# Altium project FPGA_Module.PrjPcb
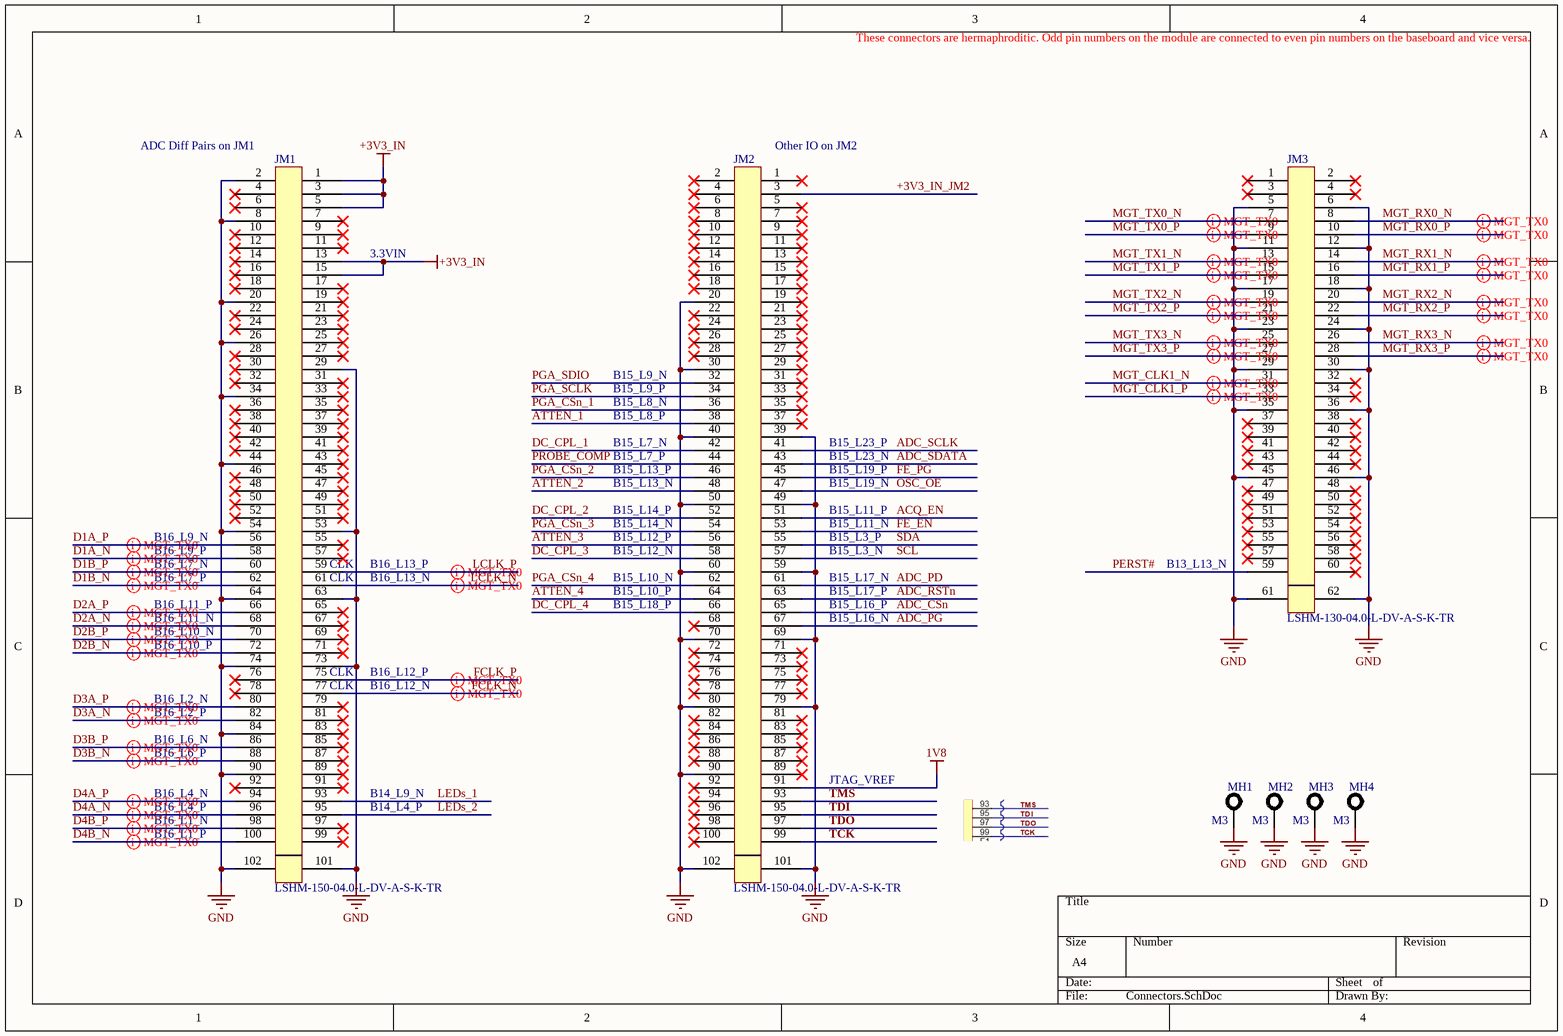
[diagram p0: Connectors.SchDoc]
2 sheets, 10 parts. Net scope: global (net labels, ports and power ports of the same name join across sheets).
Board file: FPGA_Module.PcbDoc
Sheets:
  Connectors.SchDoc
  FPGA_Banks_DDR3.SchDoc

## Sheet Connectors.SchDoc
size A4; SheetNumber: 1; SheetTotal: 8

### Parts
JM1  LSHM-150-04.0-L-DV-A-S-K-TR  [SAM_LSHM-150-XX.X-XX-DV-A-S]
JM2  LSHM-150-04.0-L-DV-A-S-K-TR  [SAM_LSHM-150-XX.X-XX-DV-A-S]
JM3  LSHM-130-04.0-L-DV-A-S-K-TR  [SAM_LSHM-130-XX.X-XX-DV-A-S]
MH1  M3  [MH M3]  (no BOM)
MH2  M3  [MH M3]  (no BOM)
MH3  M3  [MH M3]  (no BOM)
MH4  M3  [MH M3]  (no BOM)

### Nets
1V8: JM2.91
+3V3_IN: JM1.1 JM1.3 JM1.5 JM1.13 JM1.15
GND: JM1.2 JM1.8 JM1.20 JM1.26 JM1.29 JM1.34 JM1.44 JM1.53 JM1.54 JM1.63 JM1.64 JM1.73 JM1.74 JM1.84 JM1.90 JM1.101 JM1.102 JM2.20 JM2.30 JM2.39 JM2.40 JM2.49 JM2.50 JM2.59 JM2.60 JM2.69 JM2.70 JM2.79 JM2.80 JM2.90 JM2.101 JM2.102 JM3.5 JM3.6 JM3.11 JM3.12 JM3.17 JM3.18 JM3.23 JM3.24 JM3.29 JM3.30 JM3.35 JM3.36 JM3.45 JM3.46 JM3.61 JM3.62 MH1.1 MH2.1 MH3.1 MH4.1
+3V3_IN_JM2: JM2.3
ACQ_EN: JM2.51
ADC_CSn: JM2.65
ADC_PD: JM2.61
ADC_PG: JM2.67
ADC_RSTn: JM2.63
ADC_SCLK: JM2.41
ADC_SDATA: JM2.43
ATTEN_1: JM2.38
ATTEN_2: JM2.48
ATTEN_3: JM2.56
ATTEN_4: JM2.64
D1A_N: JM1.58
D1A_P: JM1.56
D1B_N: JM1.62
D1B_P: JM1.60
D2A_N: JM1.68
D2A_P: JM1.66
D2B_N: JM1.72
D2B_P: JM1.70
D3A_N: JM1.82
D3A_P: JM1.80
D3B_N: JM1.88
D3B_P: JM1.86
D4A_N: JM1.96
D4A_P: JM1.94
D4B_N: JM1.100
D4B_P: JM1.98
DC_CPL_1: JM2.42
DC_CPL_2: JM2.52
DC_CPL_3: JM2.58
DC_CPL_4: JM2.66
FCLK_N: JM1.77
FCLK_P: JM1.75
FE_EN: JM2.53
FE_PG: JM2.45
LCLK_N: JM1.61
LCLK_P: JM1.59
LEDs_1: JM1.93
LEDs_2: JM1.95
MGT_CLK1_N: JM3.31
MGT_CLK1_P: JM3.33
MGT_RX0_N: JM3.8
MGT_RX0_P: JM3.10
MGT_RX1_N: JM3.14
MGT_RX1_P: JM3.16
MGT_RX2_N: JM3.20
MGT_RX2_P: JM3.22
MGT_RX3_N: JM3.26
MGT_RX3_P: JM3.28
MGT_TX0_N: JM3.7
MGT_TX0_P: JM3.9
MGT_TX1_N: JM3.13
MGT_TX1_P: JM3.15
MGT_TX2_N: JM3.19
MGT_TX2_P: JM3.21
MGT_TX3_N: JM3.25
MGT_TX3_P: JM3.27
OSC_OE: JM2.47
PERST#: JM3.59
PGA_CSn_1: JM2.36
PGA_CSn_2: JM2.46
PGA_CSn_3: JM2.54
PGA_CSn_4: JM2.62
PGA_SCLK: JM2.34
PGA_SDIO: JM2.32
PROBE_COMP: JM2.44
SCL: JM2.57
SDA: JM2.55
TCK: JM2.99
TDI: JM2.95
TDO: JM2.97
TMS: JM2.93

Not connected (* = marked no-connect by the designer): JM1 4* 6* 7* 9* 10* 11* 12* 14* 16* 17* 18* 19* 21* 22* 23* 24* 25* 27* 28* 30* 31* 32* 33* 35* 36* 37* 38* 39* 40* 41* 42* 43* 45* 46* 47* 48* 49* 50* 51* 52* 55* 57* 65* 67* 69* 71* 76* 78* 79* 81* 83* 85* 87* 89* 91* 92* 97* 99*; JM2 1* 2* 4* 5* 6* 7* 8* 9* 10* 11* 12* 13* 14* 15* 16* 17* 18* 19* 21* 22* 23* 24* 25* 26* 27* 28* 29* 31* 33* 35* 37* 68* 71* 72* 73* 74* 75* 76* 77* 78* 81* 82* 83* 84* 85* 86* 87* 88* 89* 92* 94* 96* 98* 100*; JM3 1* 2* 3* 4* 32* 34* 37* 38* 39* 40* 41* 42* 43* 44* 47* 48* 49* 50* 51* 52* 53* 54* 55* 56* 57* 58* 60*

### Layout directives
differential pair; differential pair class PCIe: MGT_CLK1_N, MGT_CLK1_P, MGT_RX0_N, MGT_RX0_P, MGT_RX1_N, MGT_RX1_P, MGT_RX2_N, MGT_RX2_P, MGT_RX3_N, MGT_RX3_P, MGT_TX0_N, MGT_TX0_P, MGT_TX1_N, MGT_TX1_P, MGT_TX2_N, MGT_TX2_P, MGT_TX3_N, MGT_TX3_P
differential pair; differential pair class ADC LVDS: D1A_N, D1A_P, D1B_N, D1B_P, D2A_N, D2A_P, D2B_N, D2B_P, D3A_N, D3A_P, D3B_N, D3B_P, D4A_N, D4A_P, D4B_N, D4B_P, FCLK_N, FCLK_P, LCLK_N, LCLK_P

### Notes on the sheet
- These connectors are hermaphroditic. Odd pin numbers on the module are connected to even pin numbers on the baseboard and vice versa.
- (near JM1) ADC Diff Pairs on JM1
- (near JM2) Other IO on JM2
- 3.3VIN
- B15_L9_N
- B15_L9_P
- B15_L8_N
- B15_L8_P
- B15_L7_N
- B15_L23_P
- B15_L7_P
- B15_L13_P
- B15_L13_N
- B15_L14_P
- B15_L23_N
- B15_L19_P
- B15_L19_N
- B15_L11_P
- B16_L9_N
- B16_L9_P
- B16_L7_N
- B16_L7_P
- (near JM1) CLK
- B16_L13_P
- B16_L13_N
- B15_L14_N
- B15_L12_P
- B15_L12_N
- B15_L10_N
- B15_L11_N
- B15_L3_P
- B15_L3_N
- B15_L17_N
- B13_L13_N
- B16_L11_P
- B16_L11_N
- B16_L10_N
- B16_L10_P
- B15_L10_P
- B15_L18_P
- B15_L17_P
- B15_L16_P
- B15_L16_N
- B16_L2_N
- B16_L2_P
- B16_L12_P
- B16_L12_N
- B16_L6_N
- B16_L6_P
- JTAG_VREF
- B16_L4_N
- B16_L4_P
- B16_L1_N
- B16_L1_P
- B14_L9_N
- B14_L4_P

### Library data of the parts
JM1 JM2 = CONN LSHM-150-04.0-L-DV-A-S-K-TR: Supplier 1: Digi-Key; Supplier Part Number 1: SAM9033CT-ND
JM3 = CONN LSHM-130-04.0-L-DV-A-S-K-TR: Supplier 1: Digi-Key; Supplier Part Number 1: SAM9034CT-ND
MH1-MH4 = MH M3

## Sheet FPGA_Banks_DDR3.SchDoc
size A4; SheetNumber: 3; SheetTotal: 8
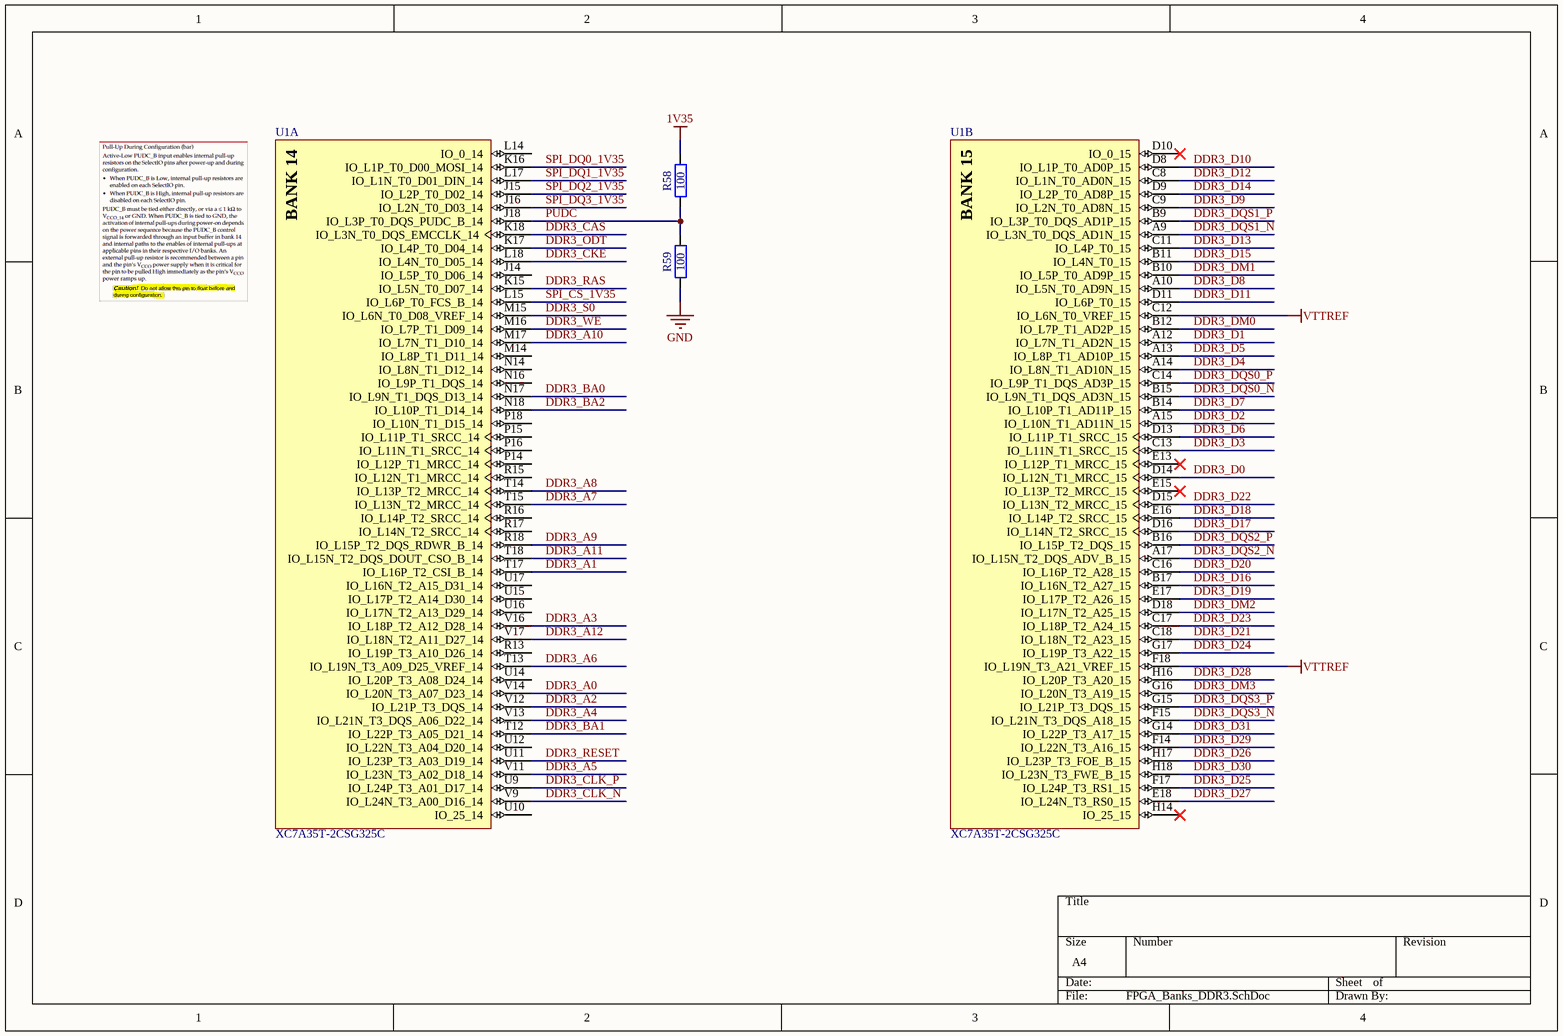
[diagram p1: FPGA_Banks_DDR3.SchDoc]

### Parts
R58  100  [GEN_R_0201]
R59  100  [GEN_R_0201]
U1  XC7A35T-2CSG325C  [CSG325]  (parts A,B of 9)

### Nets
1V35: R58.2
GND: R59.1
VTTREF: U1.C12(IO_L6N_T0_VREF_15) U1.F18(IO_L19N_T3_A21_VREF_15)
DDR3_A0: U1.V14(IO_L20N_T3_A07_D23_14)
DDR3_A1: U1.T17(IO_L16P_T2_CSI_B_14)
DDR3_A2: U1.V12(IO_L21P_T3_DQS_14)
DDR3_A3: U1.V16(IO_L18P_T2_A12_D28_14)
DDR3_A4: U1.V13(IO_L21N_T3_DQS_A06_D22_14)
DDR3_A5: U1.V11(IO_L23N_T3_A02_D18_14)
DDR3_A6: U1.T13(IO_L19N_T3_A09_D25_VREF_14)
DDR3_A7: U1.T15(IO_L13N_T2_MRCC_14)
DDR3_A8: U1.T14(IO_L13P_T2_MRCC_14)
DDR3_A9: U1.R18(IO_L15P_T2_DQS_RDWR_B_14)
DDR3_A10: U1.M17(IO_L7N_T1_D10_14)
DDR3_A11: U1.T18(IO_L15N_T2_DQS_DOUT_CSO_B_14)
DDR3_A12: U1.V17(IO_L18N_T2_A11_D27_14)
DDR3_BA0: U1.N17(IO_L9N_T1_DQS_D13_14)
DDR3_BA1: U1.T12(IO_L22P_T3_A05_D21_14)
DDR3_BA2: U1.N18(IO_L10P_T1_D14_14)
DDR3_CAS: U1.K18(IO_L3N_T0_DQS_EMCCLK_14)
DDR3_CKE: U1.L18(IO_L4N_T0_D05_14)
DDR3_CLK_N: U1.V9(IO_L24N_T3_A00_D16_14)
DDR3_CLK_P: U1.U9(IO_L24P_T3_A01_D17_14)
DDR3_D0: U1.D14(IO_L12N_T1_MRCC_15)
DDR3_D1: U1.A12(IO_L7N_T1_AD2N_15)
DDR3_D2: U1.A15(IO_L10N_T1_AD11N_15)
DDR3_D3: U1.C13(IO_L11N_T1_SRCC_15)
DDR3_D4: U1.A14(IO_L8N_T1_AD10N_15)
DDR3_D5: U1.A13(IO_L8P_T1_AD10P_15)
DDR3_D6: U1.D13(IO_L11P_T1_SRCC_15)
DDR3_D7: U1.B14(IO_L10P_T1_AD11P_15)
DDR3_D8: U1.A10(IO_L5N_T0_AD9N_15)
DDR3_D9: U1.C9(IO_L2N_T0_AD8N_15)
DDR3_D10: U1.D8(IO_L1P_T0_AD0P_15)
DDR3_D11: U1.D11(IO_L6P_T0_15)
DDR3_D12: U1.C8(IO_L1N_T0_AD0N_15)
DDR3_D13: U1.C11(IO_L4P_T0_15)
DDR3_D14: U1.D9(IO_L2P_T0_AD8P_15)
DDR3_D15: U1.B11(IO_L4N_T0_15)
DDR3_D16: U1.B17(IO_L16N_T2_A27_15)
DDR3_D17: U1.D16(IO_L14N_T2_SRCC_15)
DDR3_D18: U1.E16(IO_L14P_T2_SRCC_15)
DDR3_D19: U1.E17(IO_L17P_T2_A26_15)
DDR3_D20: U1.C16(IO_L16P_T2_A28_15)
DDR3_D21: U1.C18(IO_L18N_T2_A23_15)
DDR3_D22: U1.D15(IO_L13N_T2_MRCC_15)
DDR3_D23: U1.C17(IO_L18P_T2_A24_15)
DDR3_D24: U1.G17(IO_L19P_T3_A22_15)
DDR3_D25: U1.F17(IO_L24P_T3_RS1_15)
DDR3_D26: U1.H17(IO_L23P_T3_FOE_B_15)
DDR3_D27: U1.E18(IO_L24N_T3_RS0_15)
DDR3_D28: U1.H16(IO_L20P_T3_A20_15)
DDR3_D29: U1.F14(IO_L22N_T3_A16_15)
DDR3_D30: U1.H18(IO_L23N_T3_FWE_B_15)
DDR3_D31: U1.G14(IO_L22P_T3_A17_15)
DDR3_DM0: U1.B12(IO_L7P_T1_AD2P_15)
DDR3_DM1: U1.B10(IO_L5P_T0_AD9P_15)
DDR3_DM2: U1.D18(IO_L17N_T2_A25_15)
DDR3_DM3: U1.G16(IO_L20N_T3_A19_15)
DDR3_DQS0_N: U1.B15(IO_L9N_T1_DQS_AD3N_15)
DDR3_DQS0_P: U1.C14(IO_L9P_T1_DQS_AD3P_15)
DDR3_DQS1_N: U1.A9(IO_L3N_T0_DQS_AD1N_15)
DDR3_DQS1_P: U1.B9(IO_L3P_T0_DQS_AD1P_15)
DDR3_DQS2_N: U1.A17(IO_L15N_T2_DQS_ADV_B_15)
DDR3_DQS2_P: U1.B16(IO_L15P_T2_DQS_15)
DDR3_DQS3_N: U1.F15(IO_L21N_T3_DQS_A18_15)
DDR3_DQS3_P: U1.G15(IO_L21P_T3_DQS_15)
DDR3_ODT: U1.K17(IO_L4P_T0_D04_14)
DDR3_RAS: U1.K15(IO_L5N_T0_D07_14)
DDR3_RESET: U1.U11(IO_L23P_T3_A03_D19_14)
DDR3_S0: U1.M15(IO_L6N_T0_D08_VREF_14)
DDR3_WE: U1.M16(IO_L7P_T1_D09_14)
PUDC: R58.1 R59.2 U1.J18(IO_L3P_T0_DQS_PUDC_B_14)
SPI_CS_1V35: U1.L15(IO_L6P_T0_FCS_B_14)
SPI_DQ0_1V35: U1.K16(IO_L1P_T0_D00_MOSI_14)
SPI_DQ1_1V35: U1.L17(IO_L1N_T0_D01_DIN_14)
SPI_DQ2_1V35: U1.J15(IO_L2P_T0_D02_14)
SPI_DQ3_1V35: U1.J16(IO_L2N_T0_D03_14)

Not connected (* = marked no-connect by the designer): U1 D10(IO_0_15)* E13(IO_L12P_T1_MRCC_15)* E15(IO_L13P_T2_MRCC_15)* H14(IO_25_15)* J14(IO_L5P_T0_D06_14) L14(IO_0_14) M14(IO_L8P_T1_D11_14) N14(IO_L8N_T1_D12_14) N16(IO_L9P_T1_DQS_14) P14(IO_L12P_T1_MRCC_14) P15(IO_L11P_T1_SRCC_14) P16(IO_L11N_T1_SRCC_14) P18(IO_L10N_T1_D15_14) R13(IO_L19P_T3_A10_D26_14) R15(IO_L12N_T1_MRCC_14) R16(IO_L14P_T2_SRCC_14) R17(IO_L14N_T2_SRCC_14) U10(IO_25_14) U12(IO_L22N_T3_A04_D20_14) U14(IO_L20P_T3_A08_D24_14) U15(IO_L17P_T2_A14_D30_14) U16(IO_L17N_T2_A13_D29_14) U17(IO_L16N_T2_A15_D31_14)

### Notes on the sheet
- (in symbol XC7A35T-2CSG325C, part A) BANK 14
- (in symbol XC7A35T-2CSG325C, part B) BANK 15

### Library data of the parts
R58 R59 = RES 100 OHM 1% 1/20W 0201: Tolerance: 1%; Power Rating: 0.05W; Package: 0201; Value: 100; Supplier 1: Digi-Key; Supplier Part Number 1: 311-100MCT-ND
U1 = XC7A35T-2CSG325C: Artix-7 FPGA, 150 User I/Os, 4 GTP, 324-Ball BGA, Speed Grade 2, Commercial Grade, Pb-Free; Manufacturer: Xilinx; Total Block RAM: 1800 Kb; GTP: 4; Clock Mgmt Tiles (CMTs): 5; Logic Cells: 33280; Available User I/O: 150; Speed Grades: 2; DatasheetVersion: v1.15; PackageVersion: Rev. 1.11; PackageReference: CSG-325; PackageDescription: 324-Ball Wire-Bond Chip-Scale BGA, Body 15 x 15 mm, Pitch 0.8 mm; Maximum Distributed RAM: 400 Kb; Operating Temperature Range: Commercial; NexusDeviceID: XC7A35T-2CSG325C; Mounting Technology: Surface Mount; PartNumber: XC7A35T-2CSG325C; ComponentLink1Description: Manufacturer URL; ComponentLink1URL: http://www.xilinx.com/; ComponentLink2Description: Datasheet; ComponentLink2URL: http://www.xilinx.com/support/documentation/data_sheets/ds180_7Series_Overview.pdf; ComponentLink3Description: Package Specification; ComponentLink3URL: http://www.xilinx.com/support/documentation/user_guides/ug475_7Series_Pkg_Pinout.pdf; ComponentLink4Description: DC and Switching Characteristics; ComponentLink4URL: http://www.xilinx.com/support/documentation/data_sheets/ds181_Artix_7_Data_Sheet.pdf; ComponentLink5Description: Package File; ComponentLink5URL: http://www.xilinx.com/support/packagefiles/a7packages/xc7a200tsbg484pkg.txt; ComponentLink6Description: Packaging and Pinout; ComponentLink6URL: http://www.xilinx.com/support/documentation/user_guides/ug475_7Series_Pkg_Pinout.pdf

## Nets that join several sheets
GND: Connectors (52 pins), FPGA_Banks_DDR3 (R59.1)